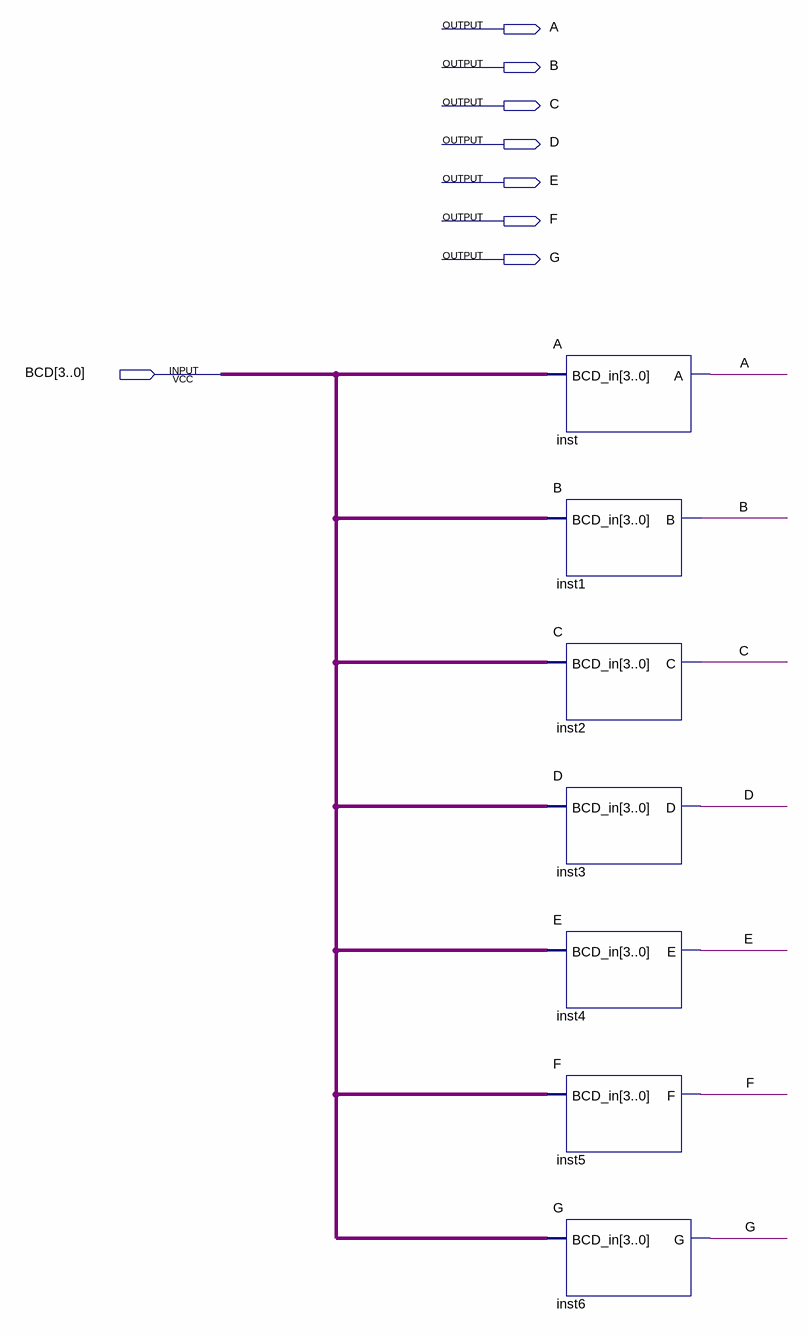
[diagram p0: schematic sheet]
// Quartus schematic DISPLAY.bdf as structural Verilog: 7 symbols, 8 pins
module DISPLAY (
  input  [3:0] BCD,
  output A,
  output B,
  output C,
  output D,
  output E,
  output F,
  output G
);

  A inst (.BCD_in(BCD), .A(A));
  B inst1 (.BCD_in(BCD), .B(B));
  C inst2 (.BCD_in(BCD), .C(C));
  D inst3 (.BCD_in(BCD), .D(D));
  E inst4 (.BCD_in(BCD), .E(E));
  F inst5 (.BCD_in(BCD), .F(F));
  G inst6 (.BCD_in(BCD), .G(G));
endmodule
